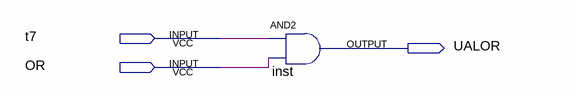
[diagram p0: schematic sheet]
// Quartus schematic UALOR.bdf as structural Verilog: 1 symbols, 3 pins
module UALOR (
  input  t7,
  input  OR,
  output UALOR
);

  and inst (UALOR, t7, OR);
endmodule
